# Altium project MoveH.PrjPcb
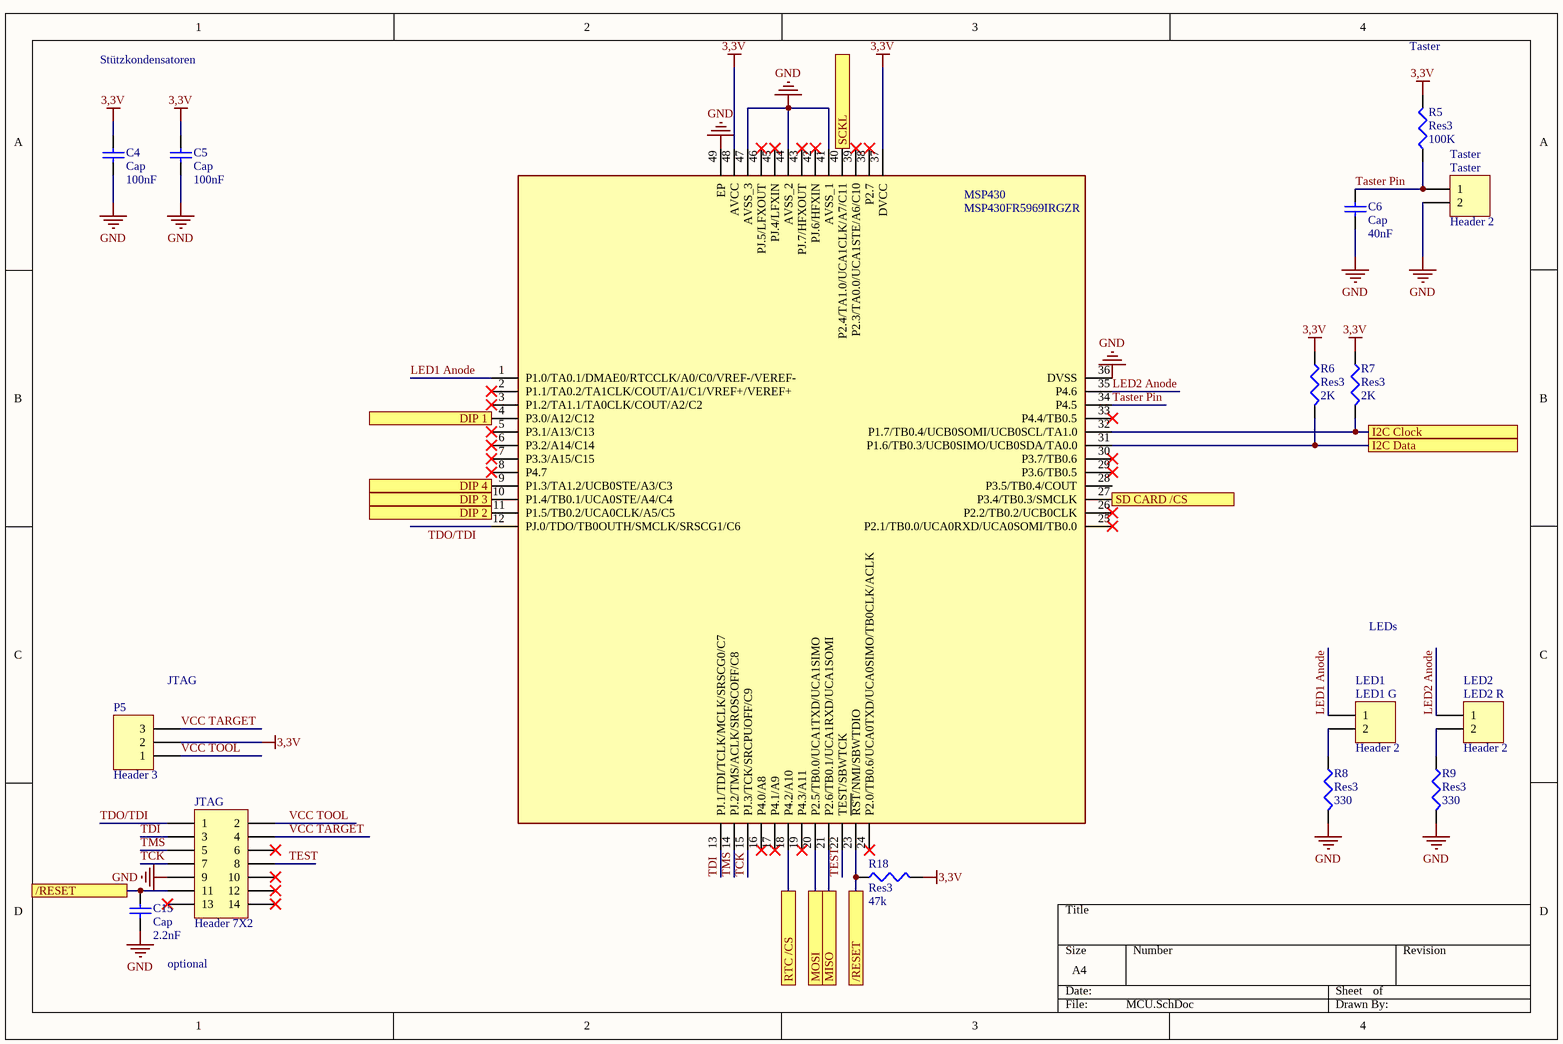
[diagram p0: MCU.SchDoc]
5 sheets, 70 parts. Net scope: flat (ports and power ports of the same name join across sheets).
Board files: MoveH Messkette.PcbDoc, MoveH Messkette einseitig.PcbDoc, MoveH Messkette einseitig V2.PcbDoc
Sheets:
  MCU.SchDoc
  GYROSCOPE.SchDoc
  RTC.SchDoc
  SD CARD.SchDoc
  POWER MANAGEMENT.SchDoc

## Sheet MCU.SchDoc
size A4

### Parts
C4  Cap  value 100nF  [1608[0603]]
C5  Cap  value 100nF  [1608[0603]]
C6  Cap  value 40nF  [1608[0603]]
C15  Cap  value 2.2nF  [1608[0603]]
JTAG  Header 7X2  [HDR2X7]
LED1_G  Header 2  [HDR1X2]
LED2_R  Header 2  [HDR1X2]
MSP430  MSP430FR5969IRGZR  [QFN50P700X700X100-49N-D]
P5  Header 3  [HDR1X3]
R5  Res3  value 100K  [J1-0603]
R6  Res3  value 2K  [J1-0603]
R7  Res3  value 2K  [J1-0603]
R8  Res3  value 330  [J1-0603]
R9  Res3  value 330  [J1-0603]
R18  Res3  value 47k  [J1-0603]
Taster  Header 2  [HDR1X2]

### Ports
/RESET, DIP 1, DIP 2, DIP 3, DIP 4, I2C Clock, I2C Data, MISO, MOSI, RTC /CS, SCKL, SD CARD /CS

### Nets
3,3V: C4.2 C5.2 MSP430.37(DVCC) MSP430.48(AVCC) P5.2 R5.2 R6.1 R7.1 R18.2
GND: C4.1 C5.1 C6.1 C15.1 JTAG.9 MSP430.36(DVSS) MSP430.41(AVSS_1) MSP430.44(AVSS_2) MSP430.47(AVSS_3) MSP430.49(EP) R8.2 R9.2 Taster.2
LED1 Anode: LED1_G.1 MSP430.1(P1.0/TA0.1/DMAE0/RTCCLK/A0/C0/VREF-/VEREF-)
LED2 Anode: LED2_R.1 MSP430.35(P4.6)
Taster Pin: C6.2 MSP430.34(P4.5) R5.1 Taster.1
TCK: JTAG.7 MSP430.15(PJ.3/TCK/SRCPUOFF/C9)
TDI: JTAG.3 MSP430.13(PJ.1/TDI/TCLK/MCLK/SRSCG0/C7)
TDO/TDI: JTAG.1 MSP430.12(PJ.0/TDO/TB0OUTH/SMCLK/SRSCG1/C6)
TEST: JTAG.8 MSP430.22(TEST/SBWTCK)
TMS: JTAG.5 MSP430.14(PJ.2/TMS/ACLK/SROSCOFF/C8)
VCC TARGET: JTAG.4 P5.3
VCC TOOL: JTAG.2 P5.1
NetC15_2: C15.2 JTAG.11 MSP430.23(~{RST}/NMI/SBWTDIO) R18.1 ; port /RESET
NetDIP_SW_2: MSP430.9(P1.3/TA1.2/UCB0STE/A3/C3) ; port DIP 4
NetDIP_SW_4: MSP430.10(P1.4/TB0.1/UCA0STE/A4/C4) ; port DIP 3
NetDIP_SW_6: MSP430.11(P1.5/TB0.2/UCA0CLK/A5/C5) ; port DIP 2
NetDIP_SW_8: MSP430.4(P3.0/A12/C12) ; port DIP 1
NetLED1_G_2: LED1_G.2 R8.1
NetLED2_R_2: LED2_R.2 R9.1
NetLevel_Shifter_6: MSP430.31(P1.6/TB0.3/UCB0SIMO/UCB0SDA/TA0.0) R6.2 ; port I2C Data
NetLevel_Shifter_7: MSP430.32(P1.7/TB0.4/UCB0SOMI/UCB0SCL/TA1.0) R7.2 ; port I2C Clock
NetMSP430_18: MSP430.18(P4.2/A10) ; port RTC /CS
NetMSP430_20: MSP430.20(P2.5/TB0.0/UCA1TXD/UCA1SIMO) ; port MOSI
NetMSP430_21: MSP430.21(P2.6/TB0.1/UCA1RXD/UCA1SOMI) ; port MISO
NetMSP430_27: MSP430.27(P3.4/TB0.3/SMCLK) ; port SD CARD /CS
NetMSP430_40: MSP430.40(P2.4/TA1.0/UCA1CLK/A7/C11) ; port SCKL

Not connected (* = marked no-connect by the designer): JTAG 6* 10* 12* 13* 14*; MSP430 2(P1.1/TA0.2/TA1CLK/COUT/A1/C1/VREF+/VEREF+)* 3(P1.2/TA1.1/TA0CLK/COUT/A2/C2)* 5(P3.1/A13/C13)* 6(P3.2/A14/C14)* 7(P3.3/A15/C15)* 8(P4.7)* 16(P4.0/A8)* 17(P4.1/A9)* 19(P4.3/A11)* 24(P2.0/TB0.6/UCA0TXD/UCA0SIMO/TB0CLK/ACLK)* 25(P2.1/TB0.0/UCA0RXD/UCA0SOMI/TB0.0)* 26(P2.2/TB0.2/UCB0CLK)* 28(P3.5/TB0.4/COUT) 29(P3.6/TB0.5)* 30(P3.7/TB0.6)* 33(P4.4/TB0.5)* 38(P2.7)* 39(P2.3/TA0.0/UCA1STE/A6/C10)* 42(PJ.6/HFXIN)* 43(PJ.7/HFXOUT)* 45(PJ.4/LFXIN)* 46(PJ.5/LFXOUT)*

### Notes on the sheet
- Taster
- Stützkondensatoren
- LEDs
- (near P5) JTAG
- (near LED1_G) LED1
- (near LED2_R) LED2
- optional

### Library data of the parts
C4-C6 C15 = Cap: Capacitor; Published: 8-Jun-2000; LatestRevisionDate: 17-Jul-2002; LatestRevisionNote: Re-released for DXP Platform.; PackageReference: RAD-0.3; Publisher: Altium Limited; PackageDescription: Radial Cap, Thru-Hole; 2 Leads; 0.3 in Pin Spacing
JTAG = Header 7X2: Header, 7-Pin, Dual row; LatestRevisionDate: 17-Jul-2002; LatestRevisionNote: Re-released for DXP Platform.; Publisher: Altium Limited
LED1_G LED2_R Taster = Header 2: Header, 2-Pin; LatestRevisionDate: 17-Jul-2002; LatestRevisionNote: Re-released for DXP Platform.; Publisher: Altium Limited
MSP430 = MSP430FR5969IRGZR: Integrated Circuit; Manufacturer_Name: Texas Instruments; Datasheet Link: http://www.ti.com/lit/gpn/msp430fr5969; Height: 1mm; Manufacturer_Part_Number: MSP430FR5969IRGZR
P5 = Header 3: Header, 3-Pin; LatestRevisionDate: 17-Jul-2002; LatestRevisionNote: Re-released for DXP Platform.; Publisher: Altium Limited
R5-R9 R18 = Res3: Resistor; Published: 8-Jun-2000; LatestRevisionDate: 29-May-2009; LatestRevisionNote: IPC-7351 Footprint Added.; PackageReference: J1-0603; Publisher: Altium Limited; PackageDescription: Chip Resistor

## Sheet GYROSCOPE.SchDoc
size A4
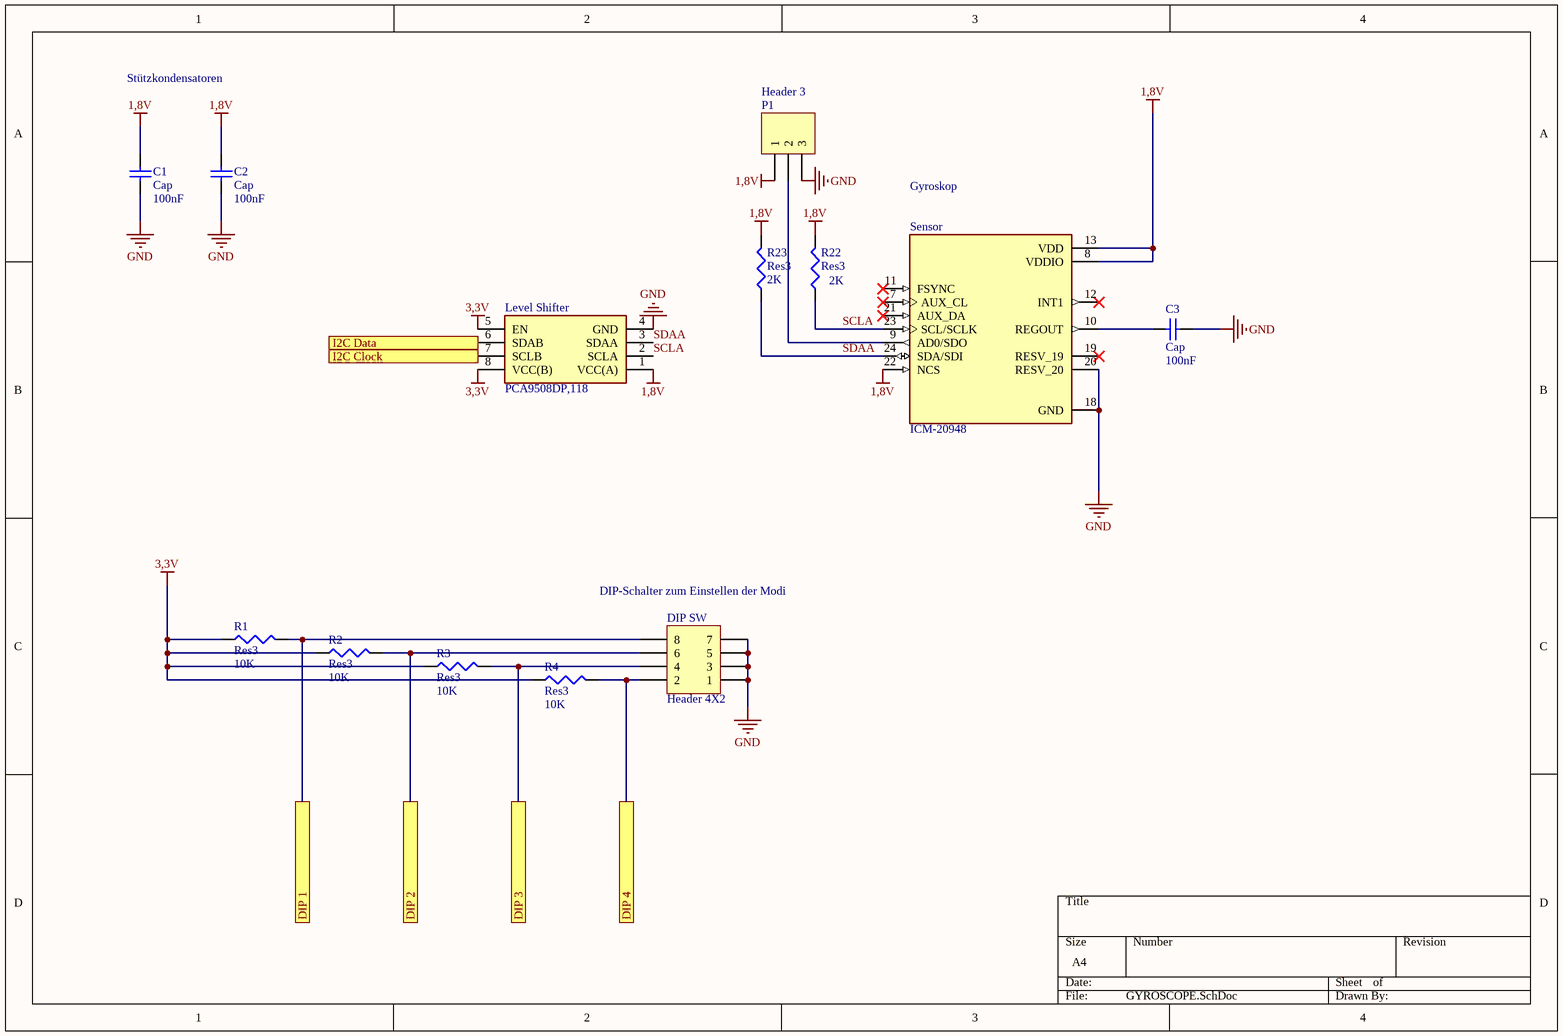
[diagram p1: GYROSCOPE.SchDoc]

### Parts
C1  Cap  value 100nF  [1608[0603]]
C2  Cap  value 100nF  [1608[0603]]
C3  Cap  value 100nF  [1608[0603]]
DIP_SW  Header 4X2  [HDR2X4]
Level_Shifter  PCA9508DP,118  [SOP65P490X110-8N]
P1  Header 3  [HDR1X3]
R1  Res3  value 10K  [J1-0603]
R2  Res3  value 10K  [J1-0603]
R3  Res3  value 10K  [J1-0603]
R4  Res3  value 10K  [J1-0603]
R22  Res3  value 2K  [J1-0603]
R23  Res3  value 2K  [J1-0603]
Sensor  ICM-20948  [QFN40P300X300X105-24N]

### Ports
DIP 1, DIP 2, DIP 3, DIP 4, I2C Clock, I2C Data

### Nets
1,8V: C1.2 C2.1 Level_Shifter.1(VCC(A)) P1.1 R22.2 R23.2 Sensor.8(VDDIO) Sensor.13(VDD) Sensor.22(NCS)
3,3V: Level_Shifter.5(EN) Level_Shifter.8(VCC(B)) R1.1 R2.1 R3.1 R4.1
GND: C1.1 C2.2 C3.2 DIP_SW.1 DIP_SW.3 DIP_SW.5 DIP_SW.7 Level_Shifter.4(GND) P1.3 Sensor.18(GND) Sensor.20(RESV_20)
SCLA: Level_Shifter.2(SCLA) R22.1 Sensor.23(SCL/SCLK)
SDAA: Level_Shifter.3(SDAA) R23.1 Sensor.24(SDA/SDI)
NetC3_1: C3.1 Sensor.10(REGOUT)
NetDIP_SW_2: DIP_SW.2 R4.2 ; port DIP 4
NetDIP_SW_4: DIP_SW.4 R3.2 ; port DIP 3
NetDIP_SW_6: DIP_SW.6 R2.2 ; port DIP 2
NetDIP_SW_8: DIP_SW.8 R1.2 ; port DIP 1
NetLevel_Shifter_6: Level_Shifter.6(SDAB) ; port I2C Data
NetLevel_Shifter_7: Level_Shifter.7(SCLB) ; port I2C Clock
NetP1_2: P1.2 Sensor.9(AD0/SDO)

Not connected (* = marked no-connect by the designer): Sensor 7(AUX_CL)* 11(FSYNC)* 12(INT1)* 19(RESV_19)* 21(AUX_DA)*

### Notes on the sheet
- Stützkondensatoren
- Gyroskop
- (near DIP_SW) DIP-Schalter zum Einstellen der Modi

### Library data of the parts
C1-C3 = Cap: Capacitor; Published: 8-Jun-2000; LatestRevisionDate: 17-Jul-2002; LatestRevisionNote: Re-released for DXP Platform.; PackageReference: RAD-0.3; Publisher: Altium Limited; PackageDescription: Radial Cap, Thru-Hole; 2 Leads; 0.3 in Pin Spacing
DIP_SW = Header 4X2: Header, 4-Pin, Dual row; LatestRevisionDate: 17-Jul-2002; LatestRevisionNote: Re-released for DXP Platform.; Publisher: Altium Limited
Level_Shifter = PCA9508DP,118: Integrated Circuit; Manufacturer_Name: NXP; Datasheet Link: http://www.nxp.com/docs/en/data-sheet/PCA9508.pdf; Height: 1.1mm; Manufacturer_Part_Number: PCA9508DP,118
P1 = Header 3: Header, 3-Pin; LatestRevisionDate: 17-Jul-2002; LatestRevisionNote: Re-released for DXP Platform.; Publisher: Altium Limited
R1-R4 R22 R23 = Res3: Resistor; Published: 8-Jun-2000; LatestRevisionDate: 29-May-2009; LatestRevisionNote: IPC-7351 Footprint Added.; PackageReference: J1-0603; Publisher: Altium Limited; PackageDescription: Chip Resistor
Sensor = ICM-20948: Accelerometer, Gyroscope, Magnetometer, 9 Axis Sensor IÂ²C, SPI Output; MF: TDK InvenSense; Package: TFQFN-24 TDK InvenSense; Availability: Unavailable; MP: ICM-20948; Value: *; SnapEDA_Link: https://www.snapeda.com/parts/ICM-20948/TDK%20InvenSense/view-part/4218863/?ref=snap; Price: None

## Sheet RTC.SchDoc
size A4
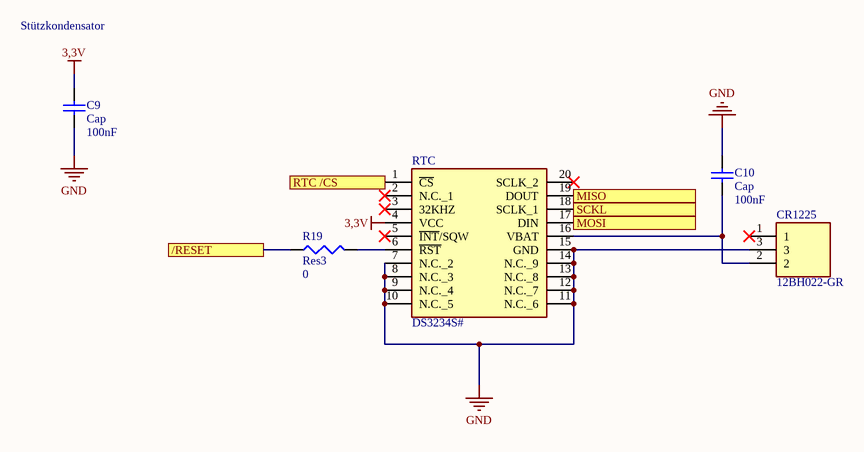
[diagram p2: RTC.SchDoc]

### Parts
C9  Cap  value 100nF  [1608[0603]]
C10  Cap  value 100nF  [1608[0603]]
CR1225  12BH022-GR  [12BH022GR]
R19  Res3  value 0  [J1-0603]
RTC  DS3234S#  [SOIC127P1032X265-20N]

### Ports
/RESET, MISO, MOSI, RTC /CS, SCKL

### Nets
3,3V: C9.2 RTC.4(VCC)
GND: C9.1 C10.2 CR1225.3 RTC.7(N.C._2) RTC.8(N.C._3) RTC.9(N.C._4) RTC.10(N.C._5) RTC.11(N.C._6) RTC.12(N.C._7) RTC.13(N.C._8) RTC.14(N.C._9) RTC.15(GND)
NetC10_1: C10.1 CR1225.2 RTC.16(VBAT)
NetC15_2: R19.1 ; port /RESET
NetMSP430_18: RTC.1(~{CS}) ; port RTC /CS
NetMSP430_20: RTC.17(DIN) ; port MOSI
NetMSP430_21: RTC.19(DOUT) ; port MISO
NetMSP430_40: RTC.18(SCLK_1) ; port SCKL
NetR19_2: R19.2 RTC.6(~{RST})

Not connected (* = marked no-connect by the designer): CR1225 1*; RTC 2(N.C._1)* 3(32KHZ)* 5(~{INT}/SQW)* 20(SCLK_2)*

### Notes on the sheet
- Stützkondensator

### Library data of the parts
C9 C10 = Cap: Capacitor; Published: 8-Jun-2000; LatestRevisionDate: 17-Jul-2002; LatestRevisionNote: Re-released for DXP Platform.; PackageReference: RAD-0.3; Publisher: Altium Limited; PackageDescription: Radial Cap, Thru-Hole; 2 Leads; 0.3 in Pin Spacing
CR1225 = 12BH022-GR: Hardware; Manufacturer_Name: Eagle Plastic Devices; Datasheet Link: https://componentsearchengine.com//12BH022-GR.pdf; Height: 4mm; Mouser2 Part Number: 12BH022-GR; Mouser2 Price/Stock: https://www.mouser.com/Search/Refine.aspx?Keyword=12BH022-GR; Manufacturer_Part_Number: 12BH022-GR
R19 = Res3: Resistor; Published: 8-Jun-2000; LatestRevisionDate: 29-May-2009; LatestRevisionNote: IPC-7351 Footprint Added.; PackageReference: J1-0603; Publisher: Altium Limited; PackageDescription: Chip Resistor
RTC = DS3234S#: Integrated Circuit; Manufacturer_Name: Maxim Integrated; Datasheet Link: https://componentsearchengine.com//DS3234S#.pdf; Height: 2.65mm; Mouser2 Part Number: 700-DS3234S#; Mouser2 Price/Stock: https://www.mouser.com/Search/Refine.aspx?Keyword=700-DS3234S%23; Manufacturer_Part_Number: DS3234S#

## Sheet SD CARD.SchDoc
size A4
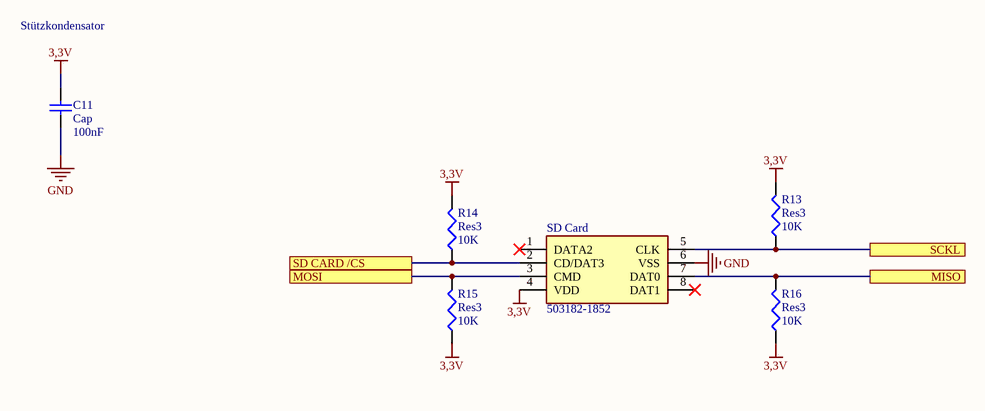
[diagram p3: SD CARD.SchDoc]

### Parts
C11  Cap  value 100nF  [1608[0603]]
R13  Res3  value 10K  [J1-0603]
R14  Res3  value 10K  [J1-0603]
R15  Res3  value 10K  [J1-0603]
R16  Res3  value 10K  [J1-0603]
SD_Card  503182-1852  [5031821852]

### Ports
MISO, MOSI, SCKL, SD CARD /CS

### Nets
3,3V: C11.2 R13.2 R14.2 R15.1 R16.1 SD_Card.4(VDD)
GND: C11.1 SD_Card.6(VSS)
NetMSP430_20: R15.2 SD_Card.3(CMD) ; port MOSI
NetMSP430_21: R16.2 SD_Card.7(DAT0) ; port MISO
NetMSP430_27: R14.1 SD_Card.2(CD/DAT3) ; port SD CARD /CS
NetMSP430_40: R13.1 SD_Card.5(CLK) ; port SCKL

Not connected (* = marked no-connect by the designer): SD_Card 1(DATA2)* 8(DAT1)*

### Notes on the sheet
- Stützkondensator

### Library data of the parts
C11 = Cap: Capacitor; Published: 8-Jun-2000; LatestRevisionDate: 17-Jul-2002; LatestRevisionNote: Re-released for DXP Platform.; PackageReference: RAD-0.3; Publisher: Altium Limited; PackageDescription: Radial Cap, Thru-Hole; 2 Leads; 0.3 in Pin Spacing
R13-R16 = Res3: Resistor; Published: 8-Jun-2000; LatestRevisionDate: 29-May-2009; LatestRevisionNote: IPC-7351 Footprint Added.; PackageReference: J1-0603; Publisher: Altium Limited; PackageDescription: Chip Resistor
SD_Card = 503182-1852: Connector; Manufacturer_Name: Molex; Datasheet Link: https://componentsearchengine.com//503182-1852.pdf; Mouser2 Part Number: 538-503182-1852; Mouser2 Price/Stock: https://www.mouser.com/Search/Refine.aspx?Keyword=538-503182-1852; Manufacturer_Part_Number: 503182-1852

## Sheet POWER MANAGEMENT.SchDoc
size A4
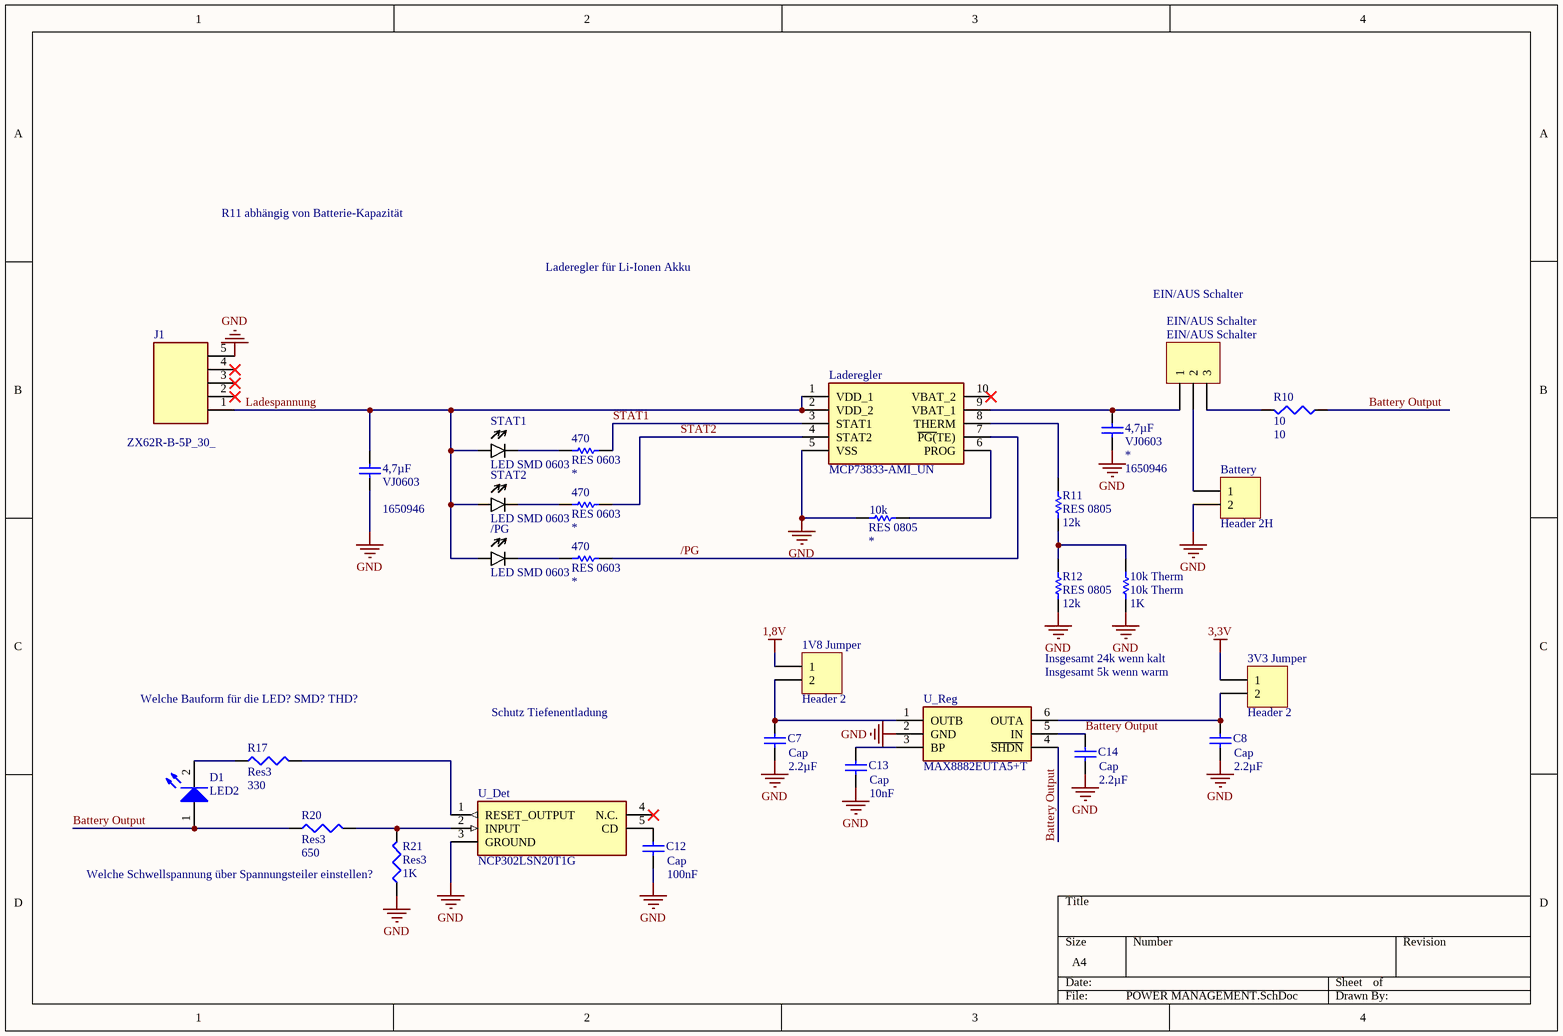
[diagram p4: POWER MANAGEMENT.SchDoc]

### Parts
(Parts that share a designator on the sheet are numbered #1, #2 ... from top to bottom, then left to right.)
1V8_Jumper  Header 2  [HDR1X2]
3V3_Jumper  Header 2  [HDR1X2]
4,7µF#1  VJ0603  Supplier Part Number 1: 1650946  [VJ0603]
4,7µF#2  VJ0603  Supplier Part Number 1: 1650946  [VJ0603]
10k  RES 0805  [D12CRCW0805]
10k_Therm  10k Therm  value 1K  [6-0805_M]
470#1  RES 0603  [Vishay D11/CRCW0603 Resistor]
470#2  RES 0603  [Vishay D11/CRCW0603 Resistor]
470#3  RES 0603  [Vishay D11/CRCW0603 Resistor]
/PG  LED SMD 0603  [SMD LED 0603]
Battery  Header 2H  [JST-PH 2-Pin 2.0mm]
C7  Cap  value 2.2µF  [1608[0603]]
C8  Cap  value 2.2µF  [1608[0603]]
C12  Cap  value 100nF  [1608[0603]]
C13  Cap  value 10nF  [1608[0603]]
C14  Cap  value 2.2µF  [1608[0603]]
D1  LED2  [HDR1X2]
EIN/AUS_Schalter  EIN/AUS Schalter  [HDR1X3]
J1  ZX62R-B-5P_30_  [ZX62R-B-5P(30)]
Laderegler  MCP73833-AMI_UN  [SOP50P490X110-10N]
R10  10  [J1-0603]
R11  RES 0805  value 12k  [D12CRCW0805]
R12  RES 0805  value 12k  [D12CRCW0805]
R17  Res3  value 330  [J1-0603]
R20  Res3  value 650  [J1-0603]
R21  Res3  value 1K  [J1-0603]
STAT1  LED SMD 0603  [SMD LED 0603]
STAT2  LED SMD 0603  [SMD LED 0603]
U_Det  NCP302LSN20T1G  [SOT95P275X110-5N]
U_Reg  MAX8882EUTA5+T  [SOT95P280X145-6N]

### Nets
1,8V: 1V8_Jumper.1
3,3V: 3V3_Jumper.1
GND: 4,7µF#1.2 4,7µF#2.2 10k.1 10k_Therm.1 Battery.2 C7.1 C8.1 C12.1 C13.1 C14.1 J1.5 Laderegler.5(VSS) R12.1 R21.1 U_Det.3(GROUND) U_Reg.2(GND)
/PG: 470#3.2 Laderegler.7(~{PG(}TE))
Battery Output: C14.2 D1.1(A) R10.1 R20.1 U_Reg.4(~{SHDN}) U_Reg.5(IN)
Ladespannung: 4,7µF#2.1 /PG.1 J1.1 Laderegler.1(VDD_1) Laderegler.2(VDD_2) STAT1.1 STAT2.1
STAT1: 470#1.2 Laderegler.3(STAT1)
STAT2: 470#2.2 Laderegler.4(STAT2)
Net1V8_Jumper_2: 1V8_Jumper.2 C7.2 U_Reg.1(OUTB)
Net3V3_Jumper_2: 3V3_Jumper.2 C8.2 U_Reg.6(OUTA)
Net4,7µF#1_1: 4,7µF#1.1 EIN/AUS_Schalter.1 Laderegler.9(VBAT_1)
Net10k_2: 10k.2 Laderegler.6(PROG)
Net10k_Therm_2: 10k_Therm.2 R11.1 R12.2
Net470#1_1: 470#1.1 STAT1.2
Net470#2_1: 470#2.1 STAT2.2
Net470#3_1: 470#3.1 /PG.2
NetBattery_1: Battery.1 EIN/AUS_Schalter.2
NetC12_2: C12.2 U_Det.5(CD)
NetC13_2: C13.2 U_Reg.3(BP)
NetD1_2: D1.2(K) R17.1
NetEIN/AUS_Schalter_3: EIN/AUS_Schalter.3 R10.2
NetLaderegler_8: Laderegler.8(THERM) R11.2
NetR17_2: R17.2 U_Det.1(RESET_OUTPUT)
NetR20_2: R20.2 R21.2 U_Det.2(INPUT)

Not connected (* = marked no-connect by the designer): J1 2* 3* 4*; Laderegler 10(VBAT_2)*; U_Det 4(N.C.)*

### Notes on the sheet
- R11 abhängig von Batterie-Kapazität
- Laderegler für Li-Ionen Akku
- EIN/AUS Schalter
- Welche Bauform für die LED? SMD? THD?
- Schutz Tiefenentladung
- Insgesamt 24k wenn kalt
- Insgesamt 5k wenn warm
- (near R21) Welche Schwellspannung über Spannungsteiler einstellen?

### Library data of the parts
1V8_Jumper 3V3_Jumper = Header 2: Header, 2-Pin; LatestRevisionDate: 17-Jul-2002; LatestRevisionNote: Re-released for DXP Platform.; Publisher: Altium Limited
4,7µF#1 4,7µF#2 = VJ0603: Ceramic Chip Capacitor Vishay Vitramon; Supplier 1: Farnell
  4,7µF#1: Value: *
10k R11 R12 = RES 0805: Chip Resistor 0805; Fitted: False; Supplier 1: Farnell; Supplier Part Number 1: 1738935
  10k: Value: *
10k_Therm = Res1: Resistor; Published: 8-Jun-2000; LatestRevisionDate: 17-Jul-2002; LatestRevisionNote: Re-released for DXP Platform.; PackageReference: AXIAL-0.3; Publisher: Altium Limited; PackageDescription: Axial Device, Thru-Hole; 2 Leads; 0.3 in Pin Spacing
470#1-470#3 = RES 0603: Chip Resistor 0603; Fitted: False; Supplier 1: Farnell; Supplier Part Number 1: 1738901RL; Value: *
Battery = Header 2H: Header, 2-Pin, Right Angle; LatestRevisionDate: 17-Jul-2002; LatestRevisionNote: Re-released for DXP Platform.; Publisher: Altium Limited
C7 C8 C12-C14 = Cap: Capacitor; Published: 8-Jun-2000; LatestRevisionDate: 17-Jul-2002; LatestRevisionNote: Re-released for DXP Platform.; PackageReference: RAD-0.3; Publisher: Altium Limited; PackageDescription: Radial Cap, Thru-Hole; 2 Leads; 0.3 in Pin Spacing
D1 = LED2: Typical RED, GREEN, YELLOW, AMBER GaAs LED; Published: 8-Jun-2000; LatestRevisionDate: 17-Jul-2002; LatestRevisionNote: Re-released for DXP Platform.; PackageVersion: Feb-2002; PackageReference: 3.2X1.6X1.1; Publisher: Altium Limited; PackageDescription: SM LED; 2 Flat Leads
EIN/AUS_Schalter = Header 3H: Header, 3-Pin, Right Angle; LatestRevisionDate: 17-Jul-2002; LatestRevisionNote: Re-released for DXP Platform.; Publisher: Altium Limited
J1 = ZX62R-B-5P_30_: Connector; Manufacturer_Name: Hirose; Manufacturer_Part_Number: ZX62R-B-5P(30)
Laderegler = MCP73833-AMI_UN: Integrated Circuit; Manufacturer_Name: Microchip; Manufacturer_Part_Number: MCP73833-AMI/UN; Datasheet Link: https://componentsearchengine.com//MCP73833-AMI_UN.pdf; Height: 1.1mm; Mouser2 Part Number: 579-MCP73833-AMI/UN; Mouser2 Price/Stock: https://www.mouser.com/Search/Refine.aspx?Keyword=579-MCP73833-AMI%2FUN
R10 R17 R20 R21 = Res3: Resistor; Published: 8-Jun-2000; LatestRevisionDate: 29-May-2009; LatestRevisionNote: IPC-7351 Footprint Added.; PackageReference: J1-0603; Publisher: Altium Limited; PackageDescription: Chip Resistor
  R10: Value: 10
U_Det = NCP302LSN20T1G: Integrated Circuit; Manufacturer_Name: ON Semiconductor; Datasheet Link: http://www.onsemi.com/pub/Collateral/NCP302-D.PDF; Height: 1.1mm; Manufacturer_Part_Number: NCP302LSN20T1G
U_Reg = MAX8882EUTA5+T: Integrated Circuit; Manufacturer_Name: Maxim Integrated; Datasheet Link: https://pdfserv.maximintegrated.com/en/ds/MAX8882-MAX8883.pdf; Height: 1.45mm; Manufacturer_Part_Number: MAX8882EUTA5+T

## Nets that join several sheets
1,8V: GYROSCOPE (9 pins), POWER MANAGEMENT (1V8_Jumper.1)
3,3V: MCU (9 pins), GYROSCOPE (6 pins), RTC (C9.2 RTC.4), SD CARD (6 pins), POWER MANAGEMENT (3V3_Jumper.1)
GND: MCU (13 pins), GYROSCOPE (11 pins), RTC (12 pins), SD CARD (C11.1 SD_Card.6), POWER MANAGEMENT (16 pins)
NetC15_2: MCU (C15.2 JTAG.11 MSP430.23 R18.1), RTC (R19.1)
NetDIP_SW_2: MCU (MSP430.9), GYROSCOPE (DIP_SW.2 R4.2)
NetDIP_SW_4: MCU (MSP430.10), GYROSCOPE (DIP_SW.4 R3.2)
NetDIP_SW_6: MCU (MSP430.11), GYROSCOPE (DIP_SW.6 R2.2)
NetDIP_SW_8: MCU (MSP430.4), GYROSCOPE (DIP_SW.8 R1.2)
NetLevel_Shifter_6: MCU (MSP430.31 R6.2), GYROSCOPE (Level_Shifter.6)
NetLevel_Shifter_7: MCU (MSP430.32 R7.2), GYROSCOPE (Level_Shifter.7)
NetMSP430_18: MCU (MSP430.18), RTC (RTC.1)
NetMSP430_20: MCU (MSP430.20), RTC (RTC.17), SD CARD (R15.2 SD_Card.3)
NetMSP430_21: MCU (MSP430.21), RTC (RTC.19), SD CARD (R16.2 SD_Card.7)
NetMSP430_27: MCU (MSP430.27), SD CARD (R14.1 SD_Card.2)
NetMSP430_40: MCU (MSP430.40), RTC (RTC.18), SD CARD (R13.1 SD_Card.5)